# EAGLE design AVR (EAGLE 7.4.0)
RFM95W
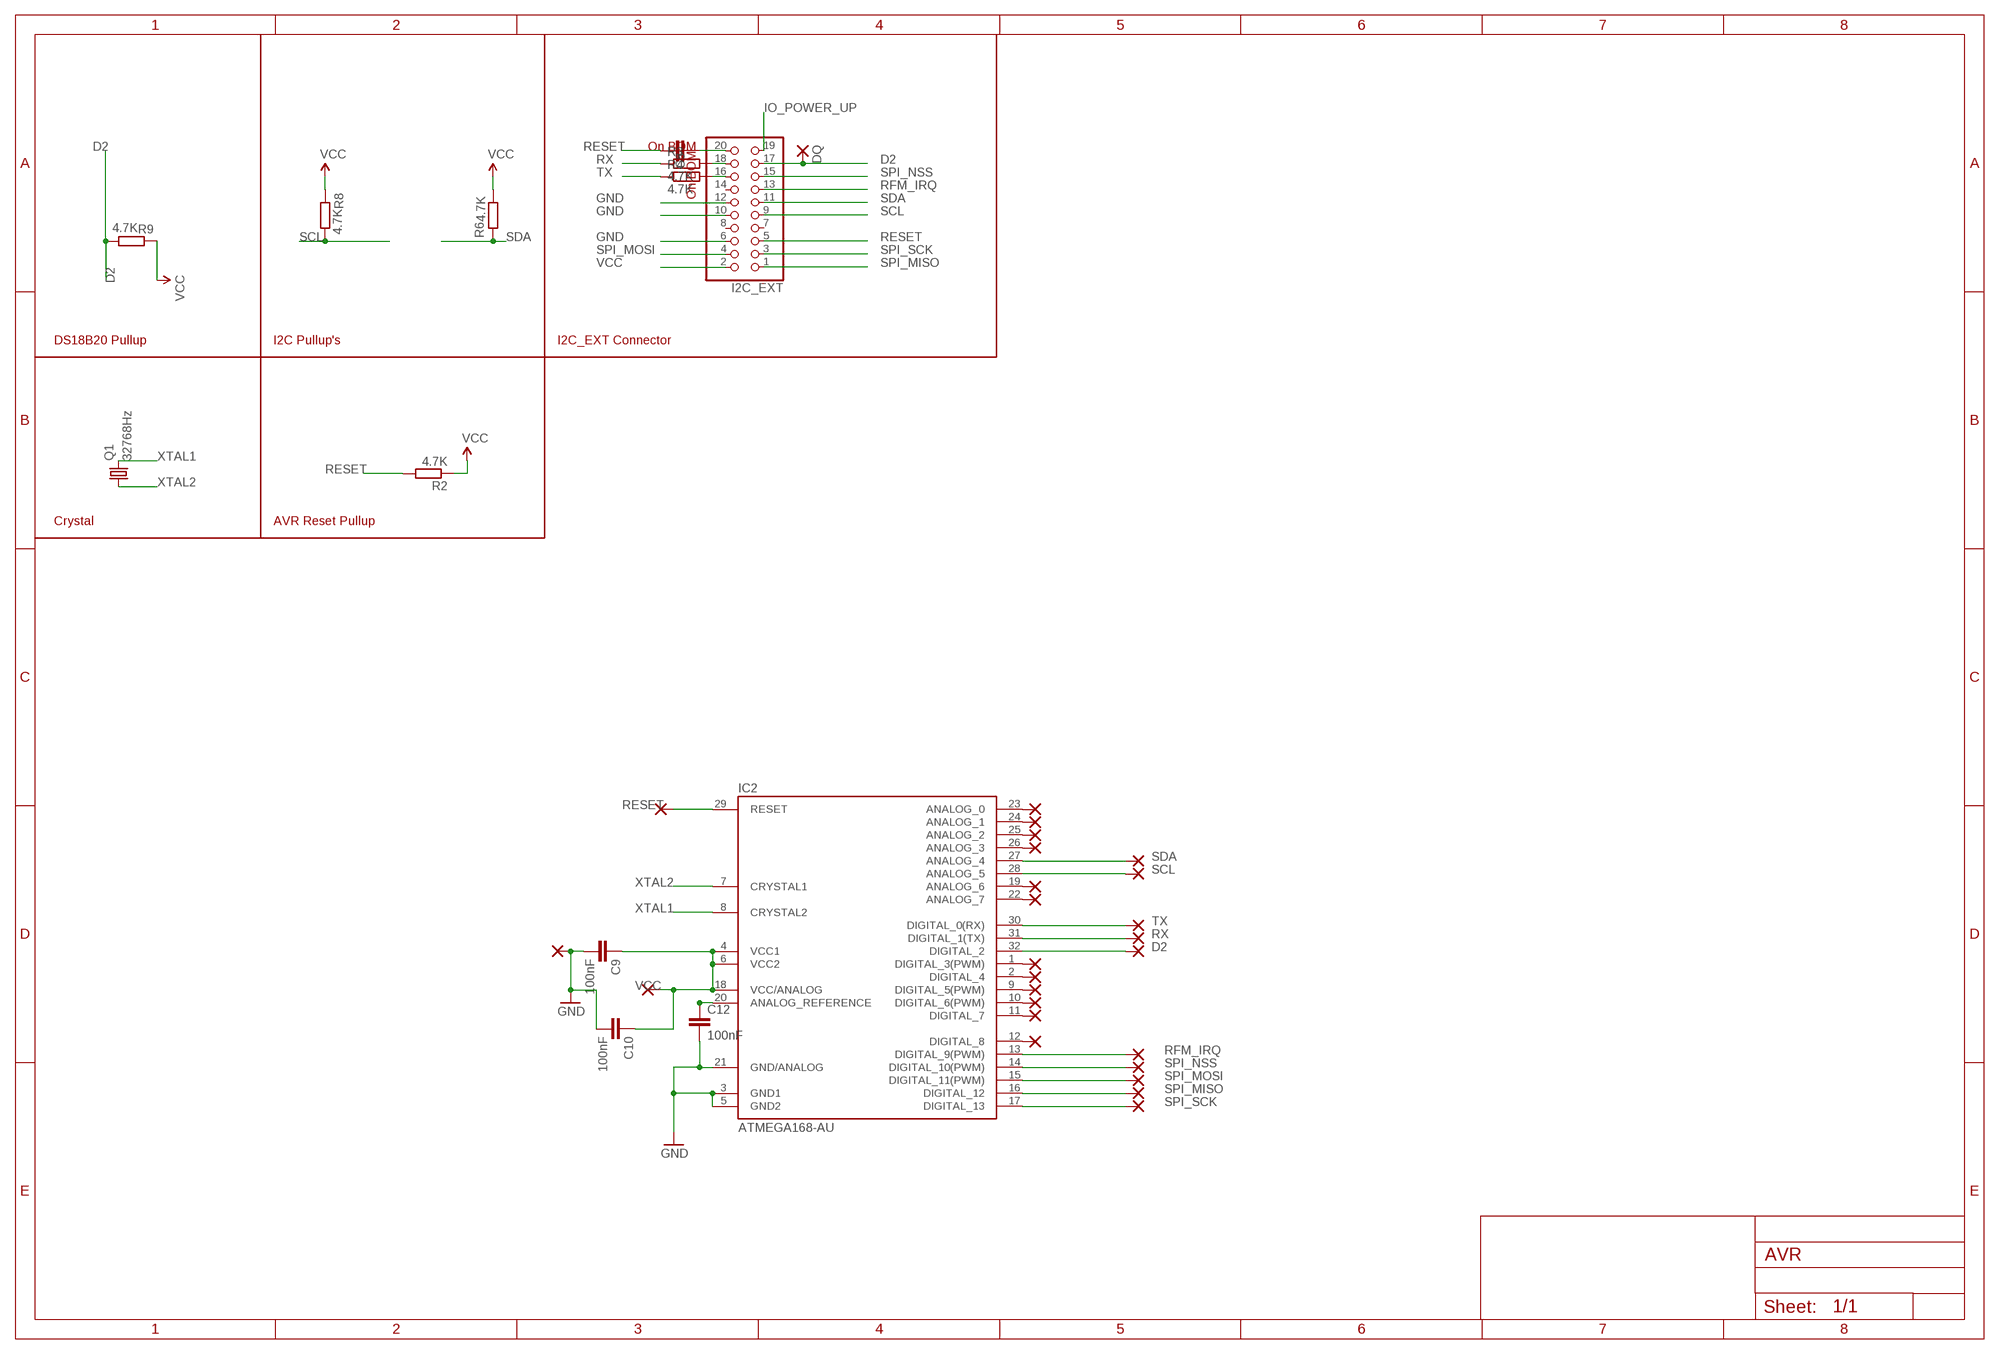
[diagram p0: schematic, sheet 1]

## Parts
C5  100nF  C-EUC0603  [C0603]
C9  100nF  C-EUC0603  [C0603]
C10  100nF  C-EUC0603  [C0603]
C12  100nF  C-EUC0603  [C0603]
DQ  2,15/1,0  [2,15/1,0]
I2C_EXT  PINHD-2X10  [2X10]
IC2  ATMEGA168-AU  [TQFP32-08]
PAD1  1,6/0,8  [1,6/0,8]
PAD2  1,6/0,8  [1,6/0,8]
PAD3  1,6/0,8  [1,6/0,8]
PAD4  1,6/0,8  [1,6/0,8]
PAD5  1,6/0,8  [1,6/0,8]
PAD6  1,6/0,8  [1,6/0,8]
PAD7  1,6/0,8  [1,6/0,8]
PAD8  1,6/0,8  [1,6/0,8]
PAD9  1,6/0,8  [1,6/0,8]
PAD10  1,6/0,8  [1,6/0,8]
PAD11  1,6/0,8  [1,6/0,8]
PAD12  1,6/0,8  [1,6/0,8]
PAD13  1,6/0,8  [1,6/0,8]
PAD14  1,6/0,8  [1,6/0,8]
PAD15  1,6/0,8  [1,6/0,8]
PAD16  1,6/0,8  [1,6/0,8]
PAD17  1,6/0,8  [1,6/0,8]
PAD18  1,6/0,8  [1,6/0,8]
PAD19  1,6/0,8  [1,6/0,8]
PAD20  1,6/0,8  [1,6/0,8]
PAD21  1,6/0,8  [1,6/0,8]
PAD22  1,6/0,8  [1,6/0,8]
PAD23  1,6/0,8  [1,6/0,8]
PAD24  1,6/0,8  [1,6/0,8]
PAD25  1,6/0,8  [1,6/0,8]
Q1  32768Hz  MC-306  [MC-306]
R2  4.7K  R-EU_R0603  [R0603]
R3  4.7K  R-EU_R0603  [R0603]
R4  4.7K  R-EU_R0603  [R0603]
R6  4.7K  R-EU_R0603  [R0603]
R8  4.7K  R-EU_R0603  [R0603]
R9  4.7K  R-EU_R0603  [R0603]

## Nets
D2: DQ.1(P) I2C_EXT.17 IC2.32(DIGITAL_2) PAD14.1(P) R9.1
GND [supply]: C9.2 C10.2 C12.2 I2C_EXT.6 I2C_EXT.10 I2C_EXT.12 IC2.3(GND1) IC2.5(GND2) IC2.21(GND/ANALOG) PAD2.1(P)
IO_POWER_UP [supply]: I2C_EXT.19
N$1: I2C_EXT.18 R3.2
N$2: IC2.23(ANALOG_0) PAD4.1(P)
N$3: I2C_EXT.16 R4.2
N$4: C5.2 I2C_EXT.20
N$5: IC2.24(ANALOG_1) PAD5.1(P)
N$6 [supply]: C12.1 IC2.20(ANALOG_REFERENCE)
N$7: IC2.25(ANALOG_2) PAD6.1(P)
N$8: IC2.19(ANALOG_6) PAD10.1(P)
N$9: IC2.1(DIGITAL_3(PWM)) PAD15.1(P)
N$10: IC2.2(DIGITAL_4) PAD16.1(P)
N$11: IC2.9(DIGITAL_5(PWM)) PAD17.1(P)
N$12: IC2.10(DIGITAL_6(PWM)) PAD18.1(P)
N$13: IC2.11(DIGITAL_7) PAD19.1(P)
N$14: IC2.26(ANALOG_3) PAD7.1(P)
N$15: IC2.22(ANALOG_7) PAD11.1(P)
N$16: IC2.12(DIGITAL_8) PAD20.1(P)
RESET: C5.1 I2C_EXT.5 IC2.29(RESET) PAD1.1(P) R2.2
RFM_IRQ: I2C_EXT.13 IC2.13(DIGITAL_9(PWM)) PAD21.1(P)
RX: IC2.31(DIGITAL_1(TX)) PAD13.1(P) R3.1
SCL: I2C_EXT.9 IC2.28(ANALOG_5) PAD9.1(P) R8.1
SDA: I2C_EXT.11 IC2.27(ANALOG_4) PAD8.1(P) R6.2
SPI_MISO: I2C_EXT.1 IC2.16(DIGITAL_12) PAD24.1(P)
SPI_MOSI: I2C_EXT.4 IC2.15(DIGITAL_11(PWM)) PAD23.1(P)
SPI_NSS: I2C_EXT.15 IC2.14(DIGITAL_10(PWM)) PAD22.1(P)
SPI_SCK: I2C_EXT.3 IC2.17(DIGITAL_13) PAD25.1(P)
TX: IC2.30(DIGITAL_0(RX)) PAD12.1(P) R4.1
VCC [supply]: C9.1 C10.1 I2C_EXT.2 IC2.4(VCC1) IC2.6(VCC2) IC2.18(VCC/ANALOG) PAD3.1(P) R2.1 R6.1 R8.2 R9.2
XTAL1: IC2.8(CRYSTAL2) Q1.4
XTAL2: IC2.7(CRYSTAL1) Q1.1
Unconnected: I2C_EXT.7 I2C_EXT.8 I2C_EXT.14

## Notes on the sheet
- On BOM | On BOM
- DS18B20 Pullup | I2C Pullup's | I2C_EXT Connector
- Crystal | AVR Reset Pullup

## Library data of the parts
C5 C9 C10 C12 = resistor:C-EU: CAPACITOR, European symbol
DQ = wirepad:2,15/1,0: THROUGH-HOLE PAD
I2C_EXT = pinhead:PINHD-2X10: PIN HEADER
IC2 = Arduino-AVR:ATMEGA168
PAD1-PAD25 = wirepad:1,6/0,8: THROUGH-HOLE PAD
Q1 = crystal:MC-306: kHz RANGE CRYSTAL UNIT SMD Source: MC-306_405_406_E07X.PDF Homepage <http://www.epsontoyocom.co.jp>; MPN: MC-306 60.0KHZ 100PPM ,12.5PF; OC_FARNELL: 1278040; OC_NEWARK: 31M5576
R2-R4 R6 R8 R9 = resistor:R-EU_: RESISTOR, European symbol

## Net classes
0 default: width 0.203 mm
1 supply: width 0.4 mm, clearance 0.203 mm
2 ant: width 2.184 mm

## Board
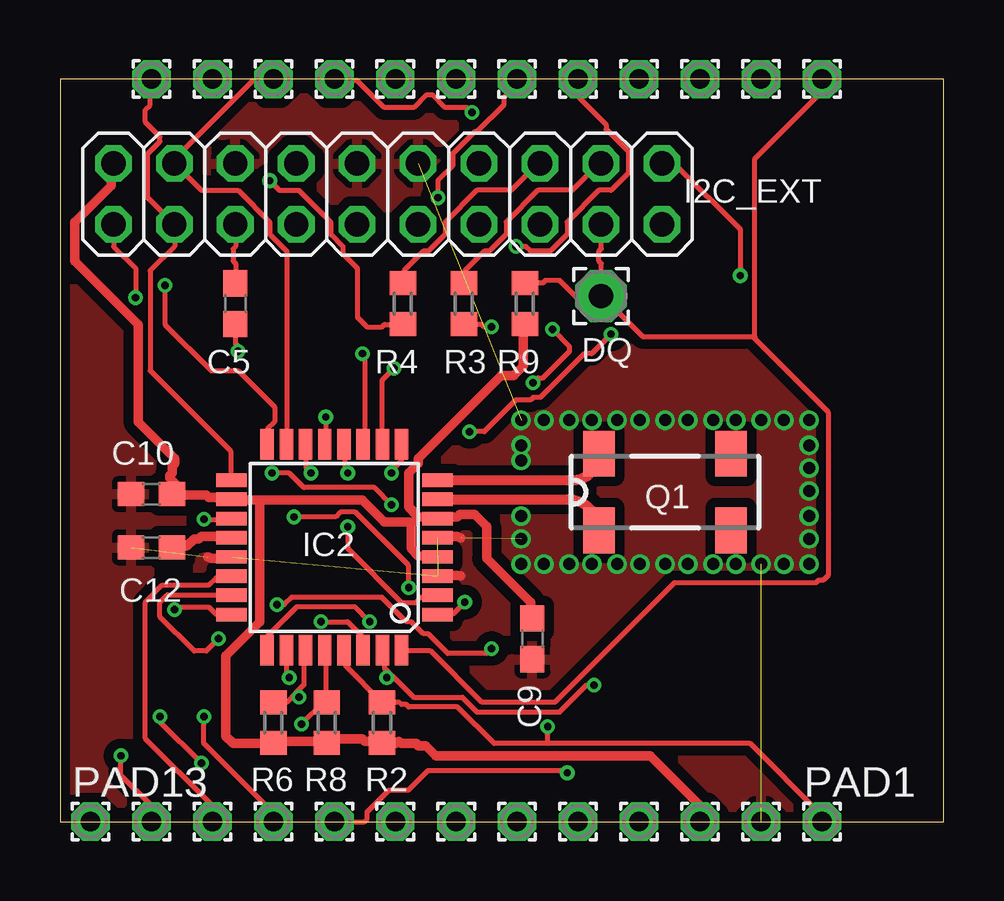
[diagram p1: board, top side]
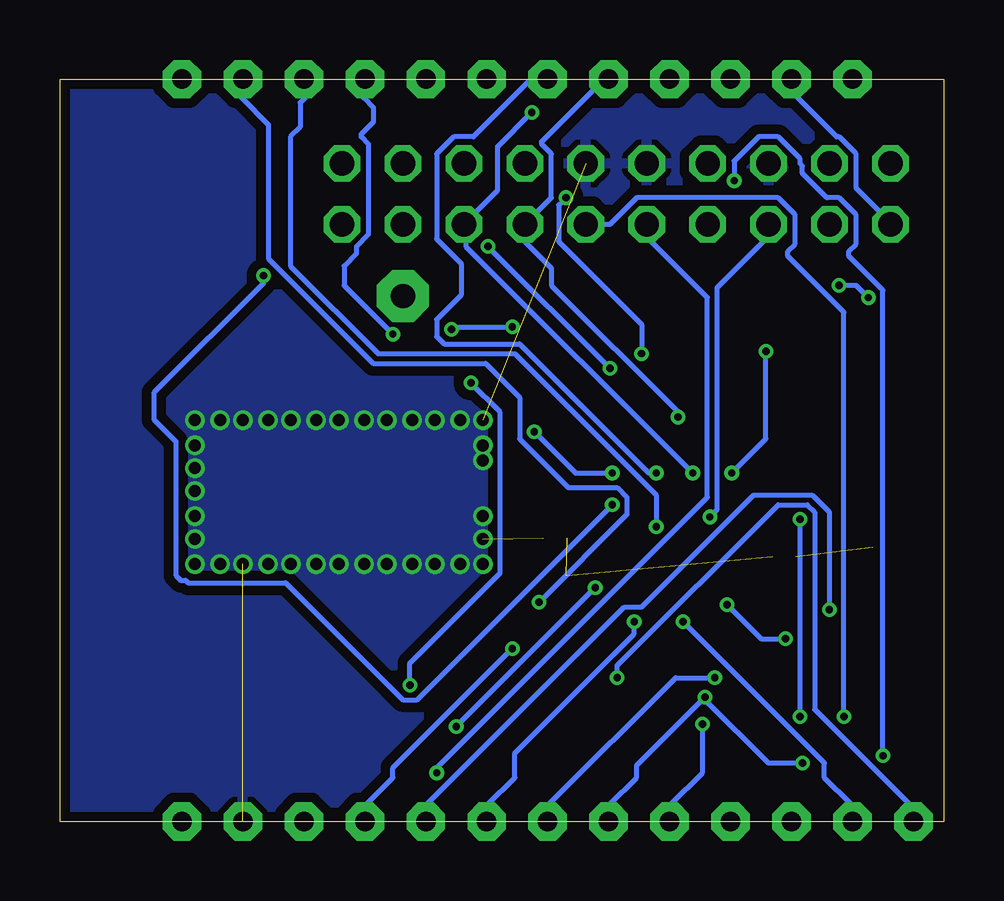
[diagram p2: board, bottom side, seen from below]

Size 36.83 x 30.95 mm. Coordinates in mm from the lower left corner, seen from the top.
Outline: 0,30.95 0,0 36.83,0 36.83,30.95 0,30.95
Copper layers (1*16): Top 0.035mm / dielectric 1.5mm / Bottom 0.035mm
Design rules "PMServicesStd": minimum track width 8mil, minimum drill 12mil, track to track 8mil, track to pad 8mil, pad to pad 8mil, via to via 8mil, smd to smd 0mil, copper to edge 10mil, drill to drill 10mil, minimum pad ring 10mil, minimum via ring 6mil, stop-mask expansion 2mil, vias tented up to drill 100mil, thermal gap 10mil
tRestrict: area -17.8,10.2 to -5.1,17.1; area -22.9,-6.4 to -18.7,33.7; area 43.2,1.3 to 47.3,41.3; area -3.8,36.2 to 36.2,40.3; area -2.2,-8.3 to 37.8,-4.1
bRestrict: area -17.8,17.8 to -5.1,24.8; area 41.9,0 to 46,40; area -3.8,36.2 to 36.2,40.3; area -24.1,-3.8 to -20,36.2; area -2.2,-8.3 to 37.8,-4.1

### Footprints (pad centres in the part's own frame; a part is rotated, then mirrored left to right if it is on the bottom)
C0603 = smd 1.1 x 1: 1 -0.85,0; 2 0.85,0
2,15/1,0 = drill 1.016 pad 2.159 octagon: 1 0,0
2X10 = drill 1.016 octagon: 1 -11.43,-1.27; 2 -11.43,1.27; 3 -8.89,-1.27; 4 -8.89,1.27; 5 -6.35,-1.27; 6 -6.35,1.27; 7 -3.81,-1.27; 8 -3.81,1.27; 9 -1.27,-1.27; 10 -1.27,1.27; 11 1.27,-1.27; 12 1.27,1.27; 13 3.81,-1.27; 14 3.81,1.27; 15 6.35,-1.27; 16 6.35,1.27; 17 8.89,-1.27; 18 8.89,1.27; 19 11.43,-1.27; 20 11.43,1.27
TQFP32-08 = smd 1.27 x 0.559: 1 -4.293,2.8; 2 -4.293,2; 3 -4.293,1.2; 4 -4.293,0.4; 5 -4.293,-0.4; 6 -4.293,-1.2; 7 -4.293,-2; 8 -4.293,-2.8; 17 4.293,-2.8; 18 4.293,-2; 19 4.293,-1.2; 20 4.293,-0.4; 21 4.293,0.4; 22 4.293,1.2; 23 4.293,2; 24 4.293,2.8 | smd 0.559 x 1.27: 9 -2.8,-4.293; 10 -2,-4.293; 11 -1.2,-4.293; 12 -0.4,-4.293; 13 0.4,-4.293; 14 1.2,-4.293; 15 2,-4.293; 16 2.8,-4.293; 25 2.8,4.293; 26 2,4.293; 27 1.2,4.293; 28 0.4,4.293; 29 -0.4,4.293; 30 -1.2,4.293; 31 -2,4.293; 32 -2.8,4.293
1,6/0,8 = drill 0.813 pad 1.6 octagon: 1 0,0
MC-306 = smd 1.3 x 1.9: 1 -2.75,-1.6; 2 2.75,-1.6; 3 2.75,1.6; 4 -2.75,1.6
R0603 = smd 1 x 1.1: 1 -0.85,0; 2 0.85,0

### Placement (x,y rotation side)
C5  7.3,21.59 270 top
C9  19.68,7.62 270 top
C10  3.81,13.65 180 top
C12  3.81,11.43 180 top
DQ  22.54,21.91 270 top
I2C_EXT  13.65,26.16 0 top
IC2  11.43,11.43 180 top
PAD1  31.75,0 0 top
PAD2  29.21,0 0 top
PAD3  26.67,0 0 top
PAD4  24.13,0 0 top
PAD5  21.59,0 0 top
PAD6  19.05,0 0 top
PAD7  16.51,0 0 top
PAD8  13.97,0 0 top
PAD9  11.43,0 0 top
PAD10  8.89,0 0 top
PAD11  6.35,0 0 top
PAD12  3.81,0 0 top
PAD13  1.27,0 0 top
PAD14  31.75,30.95 90 top
PAD15  29.21,30.95 90 top
PAD16  26.67,30.95 90 top
PAD17  24.13,30.95 90 top
PAD18  21.59,30.95 90 top
PAD19  19.05,30.95 90 top
PAD20  16.51,30.95 90 top
PAD21  13.97,30.95 90 top
PAD22  11.43,30.95 90 top
PAD23  8.89,30.95 90 top
PAD24  6.35,30.95 90 top
PAD25  3.81,30.95 90 top
Q1  25.21,13.73 0 top
R2  13.42,4.13 90 top
R3  16.83,21.59 90 top
R4  14.29,21.59 90 top
R6  8.89,4.13 90 top
R8  11.11,4.13 270 top
R9  19.37,21.59 270 top

### Tracks (layer width: path | path; a pad name or v marks a point on that pad's centre or on a via)
D2
  Top 0.203: R9.1 19.41,22.45 20.12,22.45 20.22,22.55 20.83,22.55 21.54,21.84 22.45,21.84 DQ.1 | 28.91,20.17 28.85,20.22 24.28,20.22 22.55,21.95 DQ.1 | 28.91,20.17 32,17.07 32,10.26 31.8,10.06 31.6,10.06 31.5,9.96 25.6,9.96 20.62,4.98 17.58,4.98 15.44,7.11 14.33,7.11 IC2.32 | I2C_EXT.17 22.55,24.89 22.55,23.88 22.45,23.77 22.45,23.37 22.55,23.27 22.55,22.05 DQ.1 | PAD14.1 31.7,30.89 31.7,30.38 28.96,27.64 28.96,20.22 28.91,20.17
GND  (via drill 0.5)  (6 unrouted)
  Top 0.4: IC2.21 7.11,10.97 6.3,10.97 6.17,11.03 | IC2.3 15.75,10.26 16.56,10.26 16.69,10.23 | IC2.5 15.75,11.89 16.56,11.89 16.69,11.83
  other vias: 31.21,16.73 31.21,14.73 31.21,10.73 31.21,12.73 19.21,16.73 19.21,15.05 19.21,10.73 19.21,12.73 23.21,16.73 25.21,16.73 29.21,16.73 27.21,16.73 21.21,16.73 23.21,10.73 25.21,10.73 29.21,10.73 27.21,10.73 21.21,10.73 30.16,10.73 28.16,10.73 26.16,10.73 24.16,10.73 22.16,10.73 20.16,10.73 19.21,11.78 19.21,15.69 20.16,16.73 22.16,16.73 24.16,16.73 26.16,16.73 28.16,16.73 30.16,16.73 31.21,15.69 31.21,13.78 31.21,11.78
  pour Bottom (isolate 0.406): 0,30.95 0,0 36.83,0 36.83,30.95
  pour Top (isolate 0.406): 0,30.95 0,0 36.83,0 36.83,30.95
N$1
  Top 0.203: R3.2 16.87,22.45 16.87,22.96 17.68,23.77 17.88,23.77 18.59,24.49 18.59,24.99 19.91,26.31 21.34,26.31 22.45,27.43 I2C_EXT.18
N$2  (via drill 0.3)
  Top 0.203: v6.6,7.62 6.1,7.11 5.59,7.11 4.17,8.53 4.17,9.14 4.47,9.45 7.11,9.45 IC2.23 | v9.04,9.04 9.35,9.04 9.65,9.35 13.41,9.35 14.43,8.33 14.63,8.33 15.14,7.82 15.34,7.82 16.15,7.01 17.78,7.01 v17.98,7.21
  Bottom 0.203: v6.6,7.62 7.62,7.62 v9.04,9.04 | v17.98,7.21 22.96,2.23 22.96,1.83 24.08,0.71 24.08,0 PAD4.1
N$3
  Top 0.203: R4.2 14.33,22.45 14.33,22.96 15.14,23.77 15.34,23.77 16.05,24.49 16.05,24.99 17.37,26.31 18.8,26.31 19.91,27.43 I2C_EXT.16
N$4  (via drill 0.3)
  Top 0.203: v7.42,19.61 7.42,19.81 7.32,19.91 7.32,20.73 C5.2 | v8.84,14.53 9.55,14.53 10.16,13.92 13.11,13.92 v13.82,13.21 | v28.35,22.76 28.35,24.69 25.6,27.43 25.09,27.43 I2C_EXT.20
  Bottom 0.203: v7.42,19.61 7.42,15.95 v8.84,14.53 | v13.82,13.21 21.95,5.08 22.55,5.08 27.43,9.96 31.5,9.96 31.6,10.06 31.8,10.06 32,10.26 32,15.85 32.92,16.76 32.92,17.88 28.35,22.45 v28.35,22.76
N$5  (via drill 0.3)
  Top 0.203: v4.78,8.84 4.88,8.94 6.2,8.94 6.5,8.64 7.11,8.64 IC2.24
  Bottom 0.203: v4.78,8.84 4.78,12.9 5.49,13.61 7.92,13.61 12.6,8.94 13.31,8.94 21.54,0.71 21.54,0 PAD5.1
N$6
  Top 0.4: C12.1 4.67,11.48 5.28,11.48 5.59,11.79 5.79,11.79 5.89,11.89 7.11,11.89 IC2.20
N$7  (via drill 0.3)
  Top 0.203: v12.9,8.33 12.29,8.94 9.86,8.94 8.64,7.72 8.64,7.21 IC2.25
  Bottom 0.203: v12.9,8.33 12.9,7.82 17.88,2.85 17.88,1.83 19,0.71 19,0 PAD6.1
N$8  (via drill 0.3)
  Top 0.203: v5.99,12.6 7.11,12.6 IC2.19 | v5.99,4.37 5.99,3.25 8.84,0.41 8.84,0 PAD10.1
  Bottom 0.203: v5.99,4.37 v5.99,12.6
N$9  (via drill 0.3)
  Top 0.203: v16.87,9.14 16.36,8.64 15.75,8.64 IC2.1
  Bottom 0.203: v16.87,9.14 13.21,12.8 13.21,13.51 13.61,13.92 15.65,13.92 17.68,15.95 17.68,17.68 19.1,19.1 23.77,19.1 28.14,23.47 28.14,29.06 29.26,30.18 29.26,30.89 PAD15.1
N$10  (via drill 0.3)
  Top 0.203: v11.99,12.29 11.99,11.38 14.22,9.14 14.83,9.14 15.04,9.35 15.65,9.35 IC2.2
  Bottom 0.203: v11.99,12.29 11.99,13.61 17.88,19.51 23.57,19.51 27.23,23.16 27.23,28.55 26.82,28.96 26.82,29.97 26.62,30.18 26.62,30.89 PAD16.1
N$11  (via drill 0.3)
  Top 0.203: v13.82,14.53 13.82,14.63 14.22,15.04 14.22,15.65 IC2.9 | v17.07,16.26 17.68,16.26 19,17.58 19.61,17.58 19.71,17.68 20.02,17.68 21.84,19.51 22.15,19.51 v22.96,20.32
  Bottom 0.203: v13.82,14.53 15.34,14.53 v17.07,16.26 | v22.96,20.32 24.99,22.35 24.99,23.16 24.49,23.67 24.49,23.98 23.98,24.49 23.98,28.25 24.28,28.55 24.28,28.65 23.77,29.16 23.77,29.77 24.18,30.18 24.18,30.89 PAD17.1
N$12  (via drill 0.3)
  Top 0.203: v13.92,18.9 13.41,18.39 13.41,15.75 IC2.10 | v19,23.98 19.41,23.98 19.61,23.77 20.42,23.77 21.13,24.49 21.13,24.99 22.45,26.31 22.96,26.31 23.67,27.03 23.67,27.94 22.76,28.85 22.76,29.06 21.64,30.18 21.64,30.89 PAD18.1
  Bottom 0.203: v19,23.98 v13.92,18.9
N$13  (via drill 0.3)
  Top 0.203: v12.6,19.51 12.7,19.41 12.7,15.75 IC2.11 | v15.75,26.01 15.75,26.72 16.36,27.33 16.36,27.84 17.27,28.75 17.37,28.75 18.49,29.87 18.49,30.18 19,30.68 19,30.89 PAD19.1
  Bottom 0.203: v12.6,19.51 12.6,20.73 16.05,24.18 16.05,25.7 v15.75,26.01
N$14  (via drill 0.3)
  Top 0.203: v9.55,5.99 9.45,6.1 9.45,7.11 IC2.26
  Bottom 0.203: v9.55,5.99 11.18,5.99 16.46,0.71 16.46,0 PAD7.1
N$15
  Top 0.203: IC2.22 7.11,10.16 6.5,10.16 6.2,9.86 4.27,9.86 3.56,9.14 3.56,3.45 6.3,0.71 6.3,0 PAD11.1
N$16  (via drill 0.3)
  Top 0.203: v11.99,14.53 11.89,14.63 11.89,15.65 IC2.12
  Bottom 0.203: v11.99,14.53 12.29,14.53 17.68,19.91 20.83,19.91 21.13,20.22 21.13,20.93 20.12,21.95 20.12,23.27 21.13,24.28 21.13,27.84 20.42,28.55 19.61,28.55 17.27,30.89 16.56,30.89 PAD20.1
RESET  (via drill 0.3)
  Top 0.203: C5.1 7.32,22.45 7.32,23.27 7.21,23.37 7.21,23.88 7.32,23.98 7.32,24.89 I2C_EXT.5 | IC2.29 11.89,7.11 11.89,6.5 R2.2 13.51,4.98 14.12,4.98 14.22,4.88 14.43,4.88 14.53,4.78 16.56,4.78 18.09,3.25 20.32,3.25 | 20.32,3.25 28.75,3.25 31.7,0.3 31.7,0 PAD1.1 | v9.75,12.7 11.48,12.7 11.68,12.9 12.29,12.9 14.53,10.67 v14.53,9.75 | 20.32,3.25 v20.32,3.96
  Bottom 0.203: v9.75,12.7 9.45,13.01 9.45,22.25 7.32,24.38 7.32,24.89 I2C_EXT.5 | v20.32,3.96 v14.53,9.75
RFM_IRQ  (via drill 0.3)
  Top 0.203: v11.07,16.87 11.07,15.75 IC2.13
  Bottom 0.203: v11.07,16.87 11.07,17.07 16.36,22.35 16.36,23.06 17.48,24.18 17.48,24.89 I2C_EXT.13 17.37,24.99 16.36,26.01 16.36,27.84 16.76,28.25 16.76,28.35 14.22,30.89 14.02,30.89 PAD21.1
RX  (via drill 0.3)
  Top 0.203: v17.98,20.62 17.68,20.62 17.58,20.73 16.87,20.73 R3.1 | v20.52,20.52 21.23,19.81 21.23,19.61 20.12,18.49 19.91,18.49 v19.71,18.29 | v22.25,5.69 21.95,5.69 20.83,4.57 17.37,4.57 16.76,5.18 14.73,5.18 13.77,6.15 | 13.77,6.15 13.51,6.4 13.51,7.11 IC2.31 | 13.77,6.15 v13.61,5.99
  Bottom 0.203: v17.98,20.62 20.42,20.62 v20.52,20.52 | v19.71,18.29 18.49,17.07 18.49,10.36 22.25,6.6 v22.25,5.69 | v13.61,5.99 13.61,6.5 6.91,13.21 5.69,13.21 5.38,12.9 5.38,4.67 1.32,0.61 1.32,0 PAD13.1
SCL  (via drill 0.3)
  Top 0.203: IC2.28 11.07,7.11 11.07,4.98 R8.1 10.97,4.98 v10.06,4.06 | v21.13,2.03 21.03,2.13 15.34,2.13 14.53,1.32 13.72,1.32 12.8,0.41 12.8,0.1 12.7,0 PAD9.1
  Bottom 0.203: v10.06,4.06 10.06,2.03 11.38,0.71 11.38,0 PAD9.1 | v21.13,2.03 21.13,2.23 9.86,13.51 9.86,21.84 12.29,24.28 12.29,24.89 I2C_EXT.9
SDA  (via drill 0.3)
  Top 0.203: 9.8,5.33 10.16,5.69 10.16,7.11 IC2.27 | 9.8,5.33 9.45,4.98 8.94,4.98 R6.2 | v9.96,5.18 9.8,5.33 | v4.17,4.37 4.17,4.17 v5.89,2.44
  Bottom 0.203: PAD8.1 13.92,0 13.92,0.71 12.8,1.83 12.8,2.34 v9.96,5.18 9.96,5.08 7.32,2.44 v5.89,2.44 | v4.17,4.37 4.17,21.23 6.5,23.57 6.5,23.77 6.2,24.08 6.2,25.3 6.91,26.01 12.8,26.01 13.92,24.89 14.83,24.89 I2C_EXT.11
SPI_MISO  (via drill 0.3)
  Top 0.203: v4.37,22.35 4.37,20.73 6.3,18.8 7.42,18.8 8.94,17.27 8.94,16.66 8.64,16.36 8.64,15.75 IC2.16 | v3.15,21.84 3.15,23.06 2.23,23.98 2.23,24.89 I2C_EXT.1
  Bottom 0.203: v4.37,22.35 3.66,22.35 v3.15,21.84 | PAD24.1 6.3,30.89 6.3,30.38 4.47,28.55 4.37,28.55 3.66,27.84 3.66,26.42 2.23,24.99 I2C_EXT.1
SPI_MOSI
  Top 0.203: IC2.15 9.45,15.75 9.45,23.77 8.74,24.49 8.74,24.99 7.42,26.31 5.89,26.31 4.78,27.43 I2C_EXT.4 4.67,27.53 8.03,30.89 8.84,30.89 PAD23.1
SPI_NSS  (via drill 0.3)
  Top 0.203: v10.46,14.53 10.26,14.73 10.26,15.65 IC2.14 | v17.17,29.57 16.97,29.77 16.05,29.77 15.54,30.28 15.24,30.28 14.73,29.77 13.51,29.77 12.39,30.89 11.48,30.89 PAD22.1
  Bottom 0.203: v10.46,14.53 19.91,23.98 19.91,24.89 I2C_EXT.15 19.91,24.99 18.59,26.31 18.59,28.14 v17.17,29.57
SPI_SCK
  Top 0.203: IC2.17 7.11,14.33 7.11,15.44 3.76,18.8 3.76,22.96 4.78,23.98 4.78,24.89 I2C_EXT.3 4.67,24.99 3.66,26.01 3.66,27.84 4.17,28.35 4.17,28.55 3.56,29.16 3.56,29.67 3.76,29.87 3.76,30.89 PAD25.1
TX  (via drill 0.3)
  Top 0.203: v8.74,26.72 9.14,26.31 9.96,26.31 11.28,24.99 11.28,24.49 11.79,23.98 11.79,23.67 12.39,23.06 12.39,21.03 12.8,20.62 13.41,20.62 13.51,20.73 14.22,20.73 R4.1 | v2.54,2.74 2.54,1.93 3.76,0.71 3.76,0 PAD12.1 | v10.87,8.33 11.99,8.33 12.6,7.72 12.6,7.21 IC2.30
  Bottom 0.203: v8.74,26.72 8.74,27.53 7.72,28.55 6.91,28.55 5.99,27.64 5.99,27.43 5.89,27.33 5.89,27.03 4.88,26.01 4.37,26.01 3.66,25.3 3.66,24.08 3.96,23.77 3.96,23.57 2.54,22.15 v2.54,2.74 | v10.87,8.33 4.98,2.44 4.98,1.83 3.86,0.71 3.86,0 PAD12.1
VCC
  Top 0.4: C9.1 19.61,8.53 19.61,9.14 17.78,10.97 17.78,12.29 17.27,12.8 16.66,12.8 16.56,12.7 15.75,12.7 IC2.6 15.54,12.7 14.94,12.7 | 14.94,12.7 14.53,13.11 14.53,14.53 14.94,14.94 14.94,15.14 18.39,18.59 18.9,18.59 19.3,19 19.3,20.73 R9.2 | 14.63,12.39 14.63,11.38 14.94,11.07 15.65,11.07 IC2.4 | 14.94,12.7 14.63,12.39 | 8.33,13.41 12.6,13.41 13.51,12.5 14.53,12.5 14.63,12.39 | 8.33,13.41 7.32,13.41 IC2.18 7.11,13.51 6.2,13.51 6.1,13.61 4.67,13.61 C10.1 4.88,13.72 4.88,14.02 4.57,14.33 4.57,14.43 4.67,14.53 4.67,14.83 4.78,14.94 4.78,15.14 3.25,16.66 3.25,20.73 0.61,23.37 0.61,24.99 2.13,26.52 2.13,27.43 I2C_EXT.2 | 8.33,13.41 8.33,8.33 6.91,6.91 6.91,3.56 7.21,3.25 8.74,3.25 R6.1 8.94,3.35 11.07,3.35 R8.2 11.18,3.45 12.6,3.45 12.7,3.35 13.41,3.35 R2.1 13.61,3.25 14.02,3.25 14.12,3.35 14.22,3.25 14.83,3.25 14.94,3.15 15.24,3.15 15.65,2.74 24.59,2.74 26.62,0.71 26.62,0 PAD3.1
XTAL1
  Top 0.406: IC2.8 21.36,14.23 arc90 Q1.4
XTAL2
  Top 0.406: IC2.7 21.16,13.43 arc-90 Q1.1